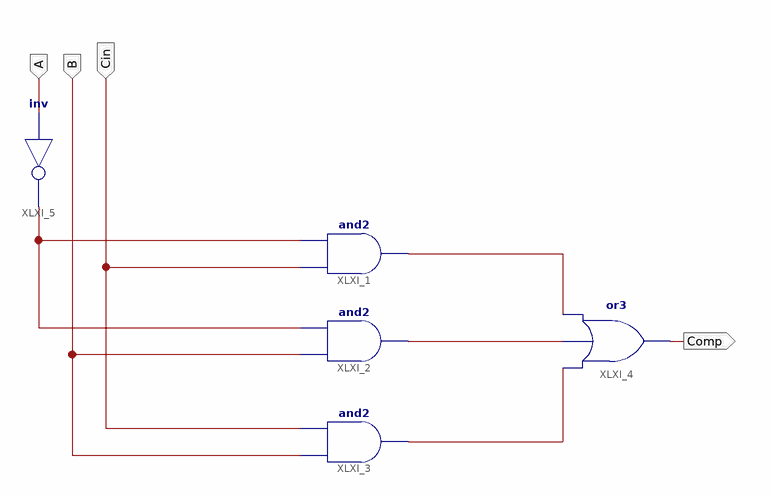
[diagram p0: schematic sheet 1]
// Xilinx ISE schematic ComparadorMaiorS.sch (xa9500xl) as structural Verilog: 5 symbols, 4 ports
module ComparadorMaiorS (
  input  A,
  input  B,
  input  Cin,
  output Comp
);

  wire XLXN_2, XLXN_3, XLXN_4, XLXN_31;

  and XLXI_1 (XLXN_2, Cin, XLXN_31);
  and XLXI_2 (XLXN_3, B, XLXN_31);
  and XLXI_3 (XLXN_4, B, Cin);
  or XLXI_4 (Comp, XLXN_4, XLXN_3, XLXN_2);
  not XLXI_5 (XLXN_31, A);
endmodule
